# Altium schematic sheet GR_Gold.SchDoc
size A4
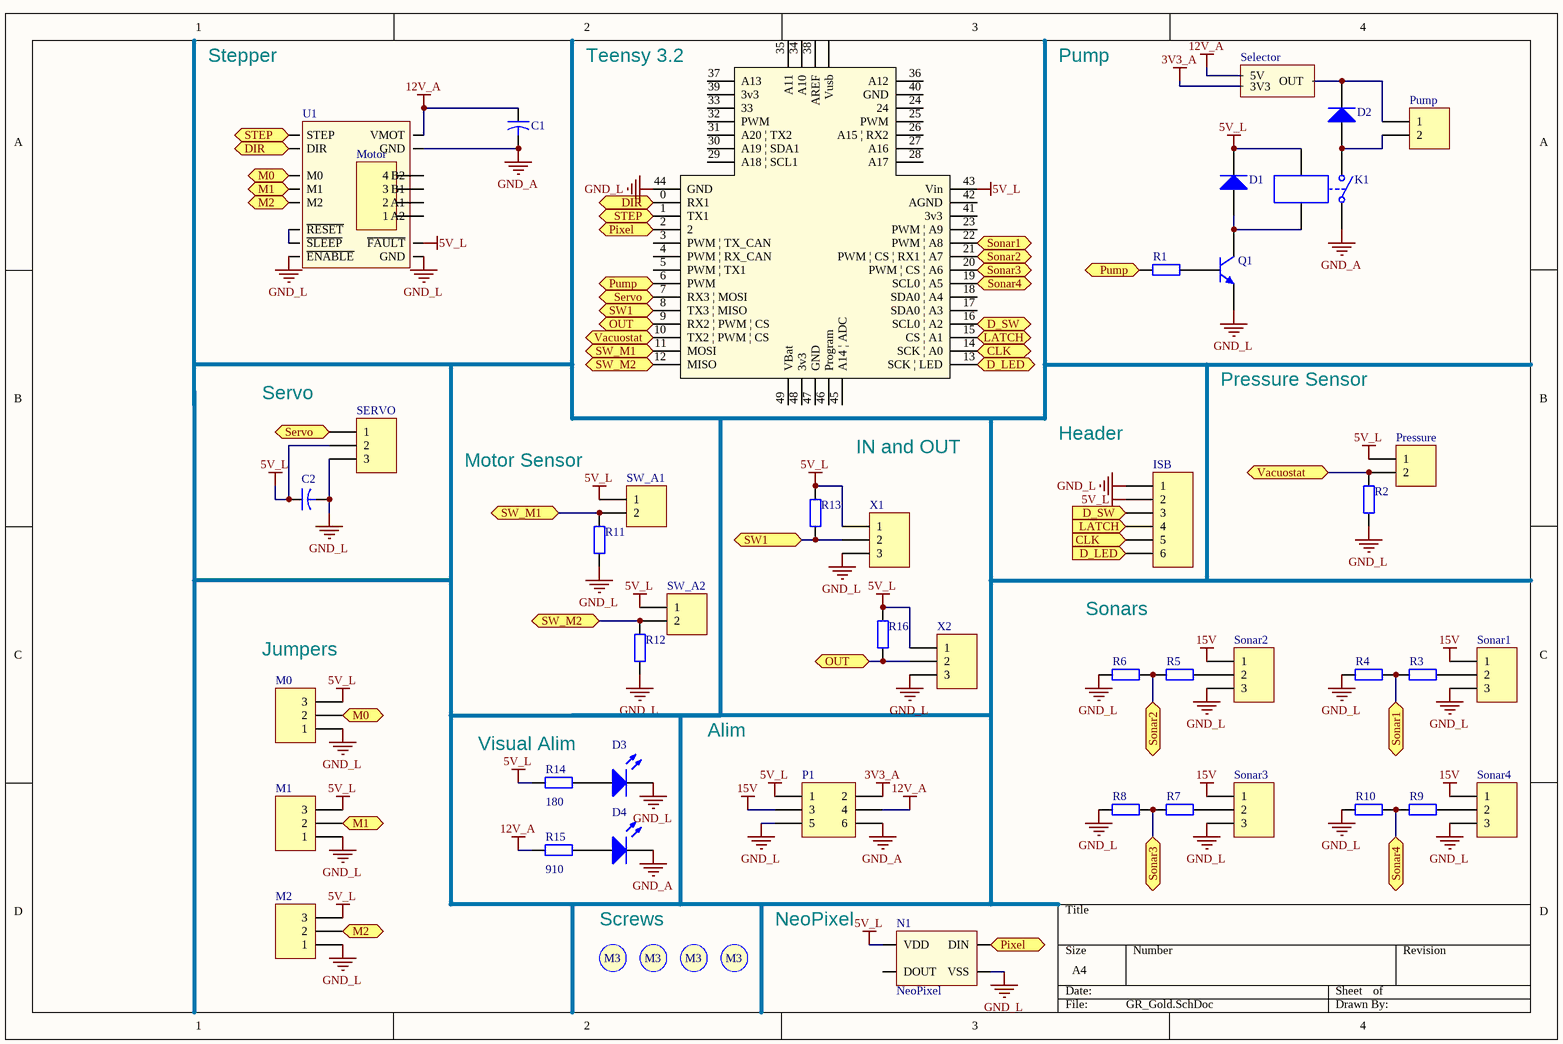
[diagram p0: GR_Gold.SchDoc]

## Parts
C1  Cap2  [Condensateur]  (value not drawn)
C2  Cap2  [Condensateur]  (value not drawn)
D1  Diode  [AXIAL-0.3]  (value not drawn)
D2  Diode  [AXIAL-0.3]  (value not drawn)
D3  LED2  [3.2X1.6X1.1]  (value not drawn)
D4  LED2  [3.2X1.6X1.1]  (value not drawn)
ISB  Header 6H  [MOLEX SPOX 6X1H]  (value not drawn)
K1  Relay-SPST  [Relay]  (value not drawn)
M0  Header 3  [HDR1X3]  (value not drawn)
M1  Header 3  [HDR1X3]  (value not drawn)
M2  Header 3  [HDR1X3]  (value not drawn)
Motor  Header 4H  [MOLEX SPOX 4X1H]  (value not drawn)
N1  NeoPixel  [Neopixel]
P1  Header 3X2H  [MOLEX_MINIFITJR_3X2]  (value not drawn)
Pressure  Header 2H  [Molex SPOX 2x1H]  (value not drawn)
Pump  Header 2H  [Molex SPOX 2x1H]  (value not drawn)
Q1  NPN  [TO-226-AA]  (value not drawn)
R1  Res2  [3.2X1.6X1.1]  (value not drawn)
R2  Res2  [3.2X1.6X1.1]  (value not drawn)
R3  Res2  [3.2X1.6X1.1]  (value not drawn)
R4  Res2  [3.2X1.6X1.1]  (value not drawn)
R5  Res2  [3.2X1.6X1.1]  (value not drawn)
R6  Res2  [3.2X1.6X1.1]  (value not drawn)
R7  Res2  [3.2X1.6X1.1]  (value not drawn)
R8  Res2  [3.2X1.6X1.1]  (value not drawn)
R9  Res2  [3.2X1.6X1.1]  (value not drawn)
R10  Res2  [3.2X1.6X1.1]  (value not drawn)
R11  Res2  [3.2X1.6X1.1]  (value not drawn)
R12  Res2  [3.2X1.6X1.1]  (value not drawn)
R13  Res2  [3.2X1.6X1.1]  (value not drawn)
R14  value 180  [3.2X1.6X1.1]  (hidden comment: Res2)
R15  value 910  [3.2X1.6X1.1]  (hidden comment: Res2)
R16  Res2  [3.2X1.6X1.1]  (value not drawn)
S1  Screw M3  [Screw M3]  (value not drawn)
S2  Screw M3  [Screw M3]  (value not drawn)
S3  Screw M3  [Screw M3]  (value not drawn)
S4  Screw M3  [Screw M3]  (value not drawn)
Selector  Voltage Selector  [VOLTAGE SELECTOR]  (value not drawn)
SERVO  Header 3H  [Molex SPOX 3x1H]  (value not drawn)
Sonar1  Header 3H  [Molex SPOX 3x1H]  (value not drawn)
Sonar2  Header 3H  [Molex SPOX 3x1H]  (value not drawn)
Sonar3  Header 3H  [Molex SPOX 3x1H]  (value not drawn)
Sonar4  Header 3H  [Molex SPOX 3x1H]  (value not drawn)
SW_A1  Header 2H  [Molex SPOX 2x1H]  (value not drawn)
SW_A2  Header 2H  [Molex SPOX 2x1H]  (value not drawn)
Teensy  Teensy 3.2  [teensy]  (value not drawn)
U1  DRV8825  [DRV8825]  (value not drawn)
X1  Header 3H  [Molex SPOX 3x1H]  (value not drawn)
X2  Header 3H  [Molex SPOX 3x1H]  (value not drawn)

## Ports
CLK, D_LED, D_SW, DIR, LATCH, M0, M1, M2, OUT, Pixel, Pump, Servo, Sonar1, Sonar2, Sonar3, Sonar4, STEP, SW1, SW_M1, SW_M2, Vacuostat

## Nets
3V3_A: P1.2 Selector.2(3V3)
5V_L: C2.1 D1.2(K) ISB.2 K1.4 M0.3 M1.3 M2.3 N1.4(VDD) P1.1 Pressure.1 R13.2 R14.1 R16.2 SERVO.2 SW_A1.1 SW_A2.1 Teensy.43(Vin) U1.10(~{FAULT}) X1.1 X2.1
12V_A: C1.1 P1.4 R15.1 Selector.1(5V) U1.16(VMOT)
15V: P1.3 Sonar1.1 Sonar2.1 Sonar3.1 Sonar4.1
GND_A: C1.2 D4.2(K) K1.1 P1.6 U1.15(GND)
GND_L: C2.2 D3.2(K) ISB.1 M0.1 M1.1 M2.1 N1.2(VSS) P1.5 Q1.3(E) R2.1 R4.1 R6.1 R8.1 R10.1 R11.1 R12.1 SERVO.3 Sonar1.3 Sonar2.3 Sonar3.3 Sonar4.3 Teensy.44(GND) U1.1(~{ENABLE}) U1.9(GND) X1.3 X2.3
CLK: ISB.5 Teensy.14(SCK_|_A0) ; port CLK
D_LED: ISB.6 Teensy.13(SCK_|_LED) ; port D_LED
D_SW: ISB.3 Teensy.16(SCL0_|_A2) ; port D_SW
DIR: Teensy.0(RX1) U1.8(DIR) ; port DIR
LATCH: ISB.4 Teensy.15(CS_|_A1) ; port LATCH
M0: M0.2 U1.2(M0) ; port M0
M1: M1.2 U1.3(M1) ; port M1
M2: M2.2 U1.4(M2) ; port M2
OUT: R16.1 Teensy.9(RX2_|_PWM_|_CS) X2.2 ; port OUT
Pixel: N1.3(DIN) Teensy.2 ; port Pixel
Pump: R1.1 Teensy.6(PWM) ; port Pump
Servo: SERVO.1 Teensy.7(RX3_|_MOSI) ; port Servo
Sonar1: R3.1 R4.2 Teensy.22(PWM_|_A8) ; port Sonar1
Sonar2: R5.1 R6.2 Teensy.21(PWM_|_CS_|_RX1_|_A7) ; port Sonar2
Sonar3: R7.1 R8.2 Teensy.20(PWM_|_CS_|_A6) ; port Sonar3
Sonar4: R9.1 R10.2 Teensy.19(SCL0_|_A5) ; port Sonar4
STEP: Teensy.1(TX1) U1.7(STEP) ; port STEP
SW1: R13.1 Teensy.8(TX3_|_MISO) X1.2 ; port SW1
SW_M1: R11.2 SW_A1.2 Teensy.11(MOSI) ; port SW_M1
SW_M2: R12.2 SW_A2.2 Teensy.12(MISO) ; port SW_M2
Vacuostat: Pressure.2 R2.2 Teensy.10(TX2_|_PWM_|_CS) ; port Vacuostat
NetD1_1: D1.1(A) K1.3 Q1.1(C)
NetD2_1: D2.1(A) K1.2 Pump.2
NetD2_2: D2.2(K) Pump.1 Selector.3(OUT)
NetD3_1: D3.1(A) R14.2
NetD4_1: D4.1(A) R15.2
NetMotor_1: Motor.1 U1.11(A2)
NetMotor_2: Motor.2 U1.12(A1)
NetMotor_3: Motor.3 U1.13(B1)
NetMotor_4: Motor.4 U1.14(B2)
NetQ1_2: Q1.2(B) R1.2
NetR3_2: R3.2 Sonar1.2
NetR5_2: R5.2 Sonar2.2
NetR7_2: R7.2 Sonar3.2
NetR9_2: R9.2 Sonar4.2
NetU1_5: U1.5(~{RESET}) U1.6(~{SLEEP})

Not connected (* = marked no-connect by the designer): N1 1(DOUT); Teensy 3(PWM_|_TX_CAN) 4(PWM_|_RX_CAN) 5(PWM_|_TX1) 17(SDA0_|_A3) 18(SDA0_|_A4) 23(PWM_|_A9) 24 25(PWM) 26(A15_|_RX2) 27(A16) 28(A17) 29(A18_|_SCL1) 30(A19_|_SDA1) 31(A20_|_TX2) 32(PWM) 33 34(A10) 35(A11) 36(A12) 37(A13) 38(AREF) 39(3v3) 40(GND) 41(3v3) 42(AGND) 45(A14_|_ADC) 46(Program) 47(GND) 48(3v3) 49(VBat) 50(Vusb)

## Notes on the sheet
- Stepper
- (near Teensy) Teensy 3.2
- Pump
- Pressure Sensor
- (near SERVO) Servo
- IN and OUT
- Header
- Motor Sensor
- (near M0) Jumpers
- Sonars
- Visual Alim
- Alim
- Screws
- NeoPixel
- (in symbol Screw M3) M3

## Library data of the parts
C1 C2 = Cap2: Capacitor; Value: 100pF; Published: 23-Sep-2002; PackageReference: CAPR5-4X5; Publisher: Altium Limited; PackageDescription: Capacitor; 2 Leads
D1 D2 = Diode: Default Diode; Published: 8-Jun-2000; LatestRevisionDate: 17-Jul-2002; LatestRevisionNote: Re-released for DXP Platform.; PackageVersion: Sep-1996; PackageReference: SMC; Publisher: Altium Limited; PackageDescription: DO-214-AB/SMC; 2 C-Bend Leads; Body 7.9 x 5.9 mm, inc. leads (LxW); Code_JEDEC: DO-214-AB
D3 D4 = LED2: Typical RED, GREEN, YELLOW, AMBER GaAs LED; Published: 8-Jun-2000; LatestRevisionDate: 17-Jul-2002; LatestRevisionNote: Re-released for DXP Platform.; PackageVersion: Feb-2002; PackageReference: 3.2X1.6X1.1; Publisher: Altium Limited; PackageDescription: SM LED; 2 Flat Leads
ISB = Header 6H: Header, 6-Pin, Right Angle; LatestRevisionDate: 17-Jul-2002; LatestRevisionNote: Re-released for DXP Platform.; Publisher: Altium Limited
K1 = Relay-SPST: Single-Pole Single-Throw Relay; Published: 24-Mar-1999; LatestRevisionDate: 17-Jul-2002; LatestRevisionNote: Re-released for DXP Platform.; PackageReference: MODULE4; Publisher: Altium Limited
M0-M2 = Header 3: Header, 3-Pin; LatestRevisionDate: 17-Jul-2002; LatestRevisionNote: Re-released for DXP Platform.; Publisher: Altium Limited
Motor = Header 4H: Header, 4-Pin, Right Angle; LatestRevisionDate: 17-Jul-2002; LatestRevisionNote: Re-released for DXP Platform.; Publisher: Altium Limited
N1 = NeoPixel: pin to pad: 1>4 2>1 3>2 4>3
P1 = Header 3X2H: Header, 3-Pin, Dual row, Right Angle; LatestRevisionDate: 17-Jul-2002; LatestRevisionNote: Re-released for DXP Platform.; Publisher: Altium Limited
Pressure SW_A1 SW_A2 = Header 2H: Header, 2-Pin, Right Angle; LatestRevisionDate: 17-Jul-2002; LatestRevisionNote: Re-released for DXP Platform.; Publisher: Altium Limited
Pump = Header 2H: Header, 2-Pin, Right Angle; pin to pad: 1>2 2>1; LatestRevisionDate: 17-Jul-2002; LatestRevisionNote: Re-released for DXP Platform.; Publisher: Altium Limited
Q1 = NPN: NPN Bipolar Transistor; Published: 8-Jun-2000; LatestRevisionDate: 17-Jul-2002; LatestRevisionNote: Re-released for DXP Platform.; PackageReference: TO-226-AA; Publisher: Altium Limited; PackageDescription: TO, Flat Index; 3 In-Line, Axial Leads; Body Dia. 4.8mm; Leads 0.55 x 0.51 mm (max); Code_JEDEC: TO-226-AA
R1-R13 R16 = Res2: Resistor; Value: 1K; Published: 8-Jun-2000; LatestRevisionDate: 17-Jul-2002; LatestRevisionNote: Re-released for DXP Platform.; PackageReference: AXIAL-0.4; Publisher: Altium Limited; PackageDescription: Axial Device, Thru-Hole; 2 Leads; 0.4 in Pin Spacing
R14 R15 = Res2: Resistor; Published: 8-Jun-2000; LatestRevisionDate: 17-Jul-2002; LatestRevisionNote: Re-released for DXP Platform.; PackageReference: AXIAL-0.4; Publisher: Altium Limited; PackageDescription: Axial Device, Thru-Hole; 2 Leads; 0.4 in Pin Spacing
Selector = Voltage Selector: Selection of voltage by soldering pads
SERVO Sonar1-Sonar4 X1 X2 = Header 3H: Header, 3-Pin, Right Angle; LatestRevisionDate: 17-Jul-2002; LatestRevisionNote: Re-released for DXP Platform.; Publisher: Altium Limited
Teensy = teensy3.2
U1 = DRV8825: Stepper Driver Module